# EAGLE design pc_ads1220_brk (EAGLE 6.4)
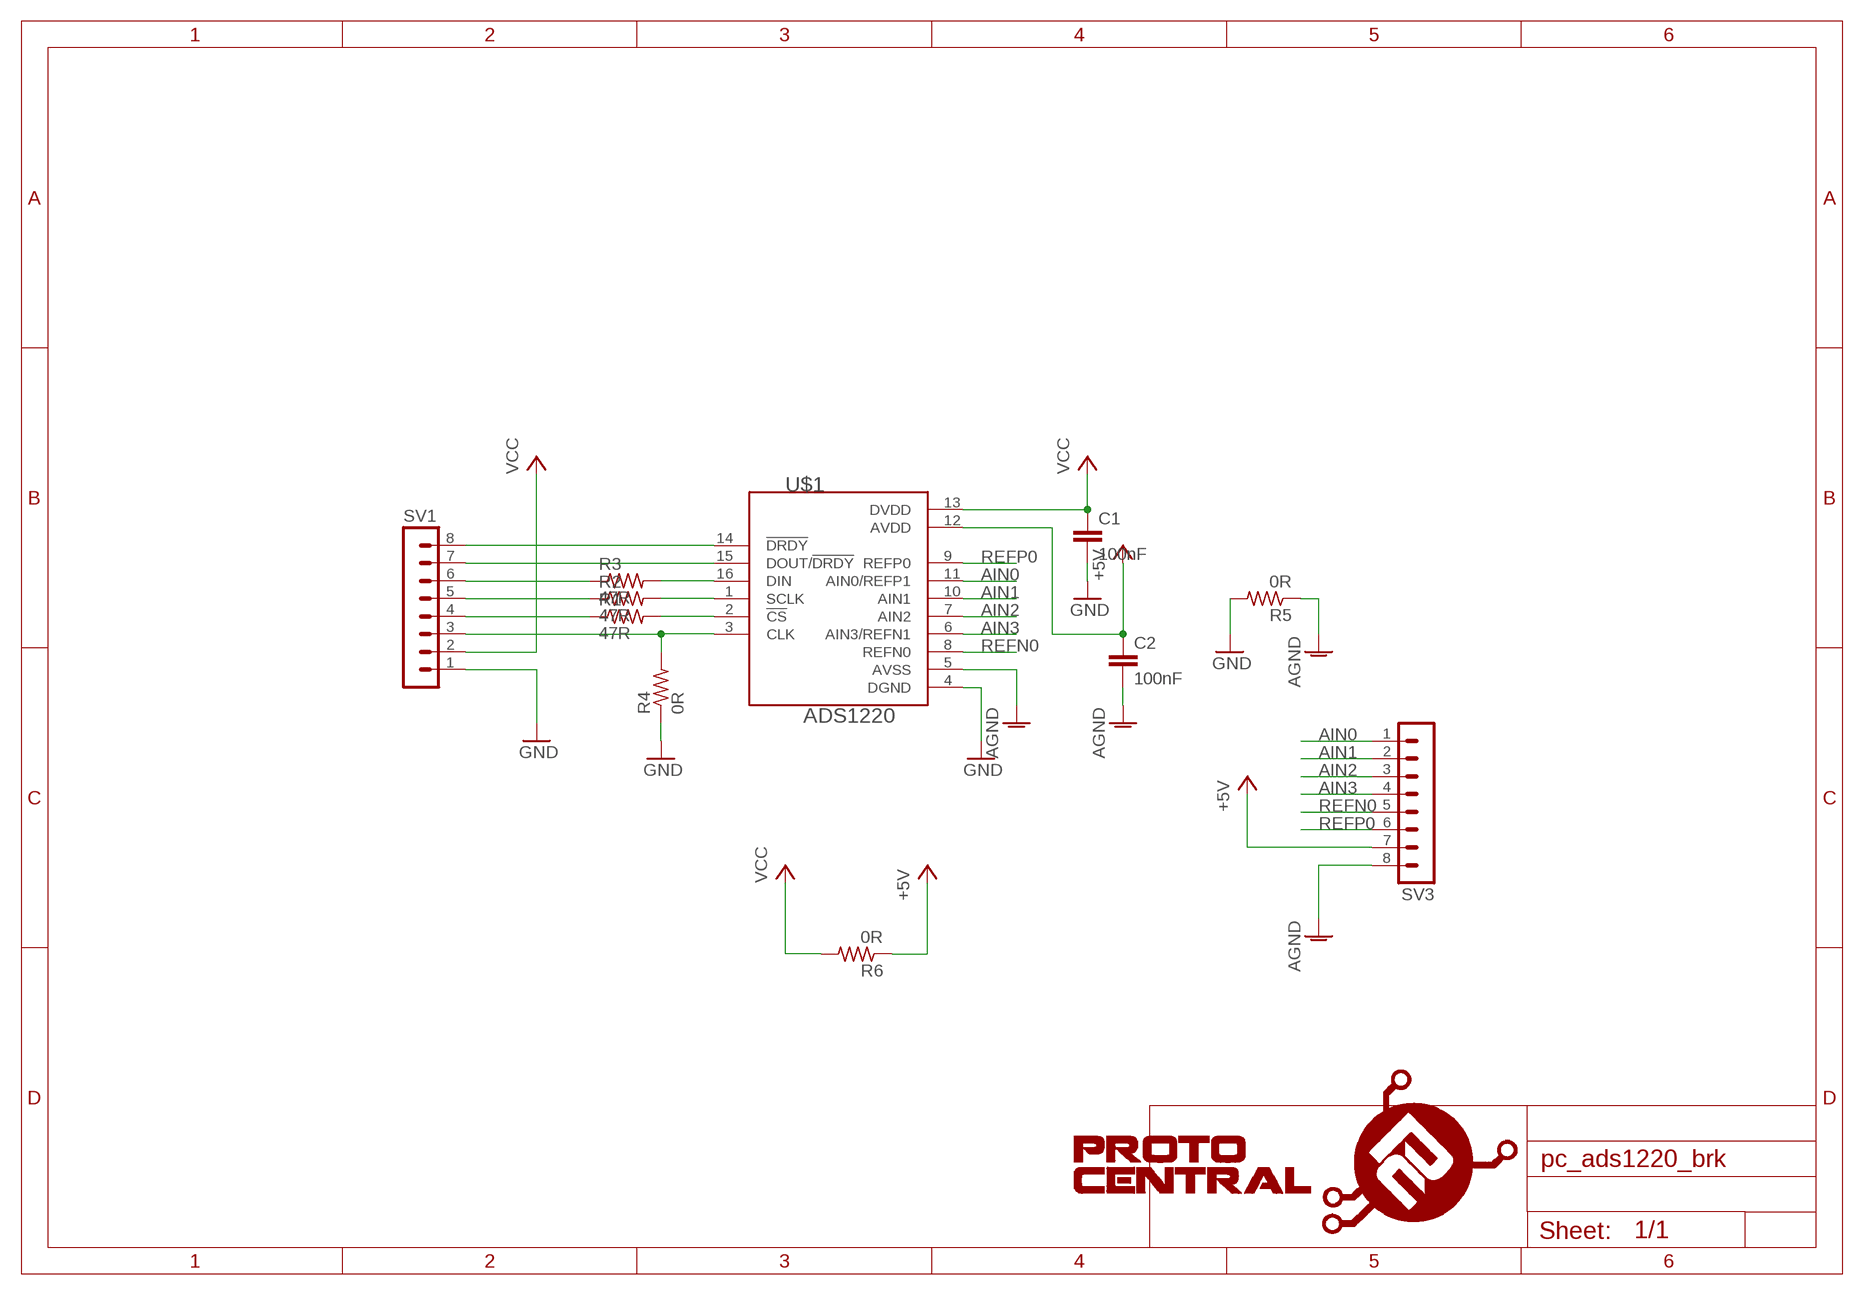
[diagram p0: schematic, sheet 1]

## Parts
C1  100nF  C-EUC0805  [C0805]
C2  100nF  C-EUC0805  [C0805]
R1  47R  R-US_R0805  [R0805]
R2  47R  R-US_R0805  [R0805]
R3  47R  R-US_R0805  [R0805]
R4  0R  R-US_R0805  [R0805]
R5  0R  R-US_R0805  [R0805]
R6  0R  R-US_R0805  [R0805]
SV1  MA08-1  [MA08-1]
SV3  MA08-1  [MA08-1]
U$1  ADS1220  [TSSOP-16]
U$3  PROTY_LOGO_WITH_TEXT  [PROTY_WITH_TEXT]

## Nets
+5V: C2.1 R6.1 SV3.7 U$1.12(AVDD)
AGND: C2.2 R5.1 SV3.8 U$1.5(AVSS)
AIN0: SV3.1 U$1.11(AIN0/REFP1)
AIN1: SV3.2 U$1.10(AIN1)
AIN2: SV3.3 U$1.7(AIN2)
AIN3: SV3.4 U$1.6(AIN3/REFN1)
GND: C1.2 R4.1 R5.2 SV1.1 U$1.4(DGND)
N$1: R3.1 SV1.6
N$2: R2.1 SV1.5
N$3: R3.2 U$1.16(DIN)
N$4: R2.2 U$1.1(SCLK)
N$5: R1.2 U$1.2(!CS)
N$6: R1.1 SV1.4
N$7: R4.2 SV1.3 U$1.3(CLK)
N$23: SV1.7 U$1.15(DOUT/!DRDY)
N$24: SV1.8 U$1.14(!DRDY)
REFN0: SV3.5 U$1.8(REFN0)
REFP0: SV3.6 U$1.9(REFP0)
VCC: C1.1 R6.2 SV1.2 U$1.13(DVDD)

## Library data of the parts
C1 C2 = rcl:C-EU: CAPACITOR, European symbol
R1-R6 = rcl:R-US_: RESISTOR, American symbol
SV1 SV3 = con-lstb:MA08-1: PIN HEADER; OC_FARNELL: unknown; OC_NEWARK: unknown
U$1 = circuitects:ADS1220
U$3 = circuitects:PROTY_LOGO_WITH_TEXT

## Board
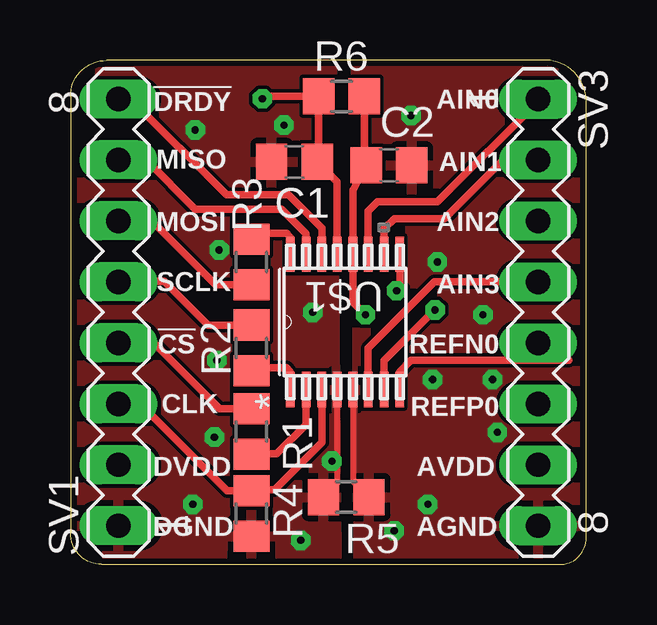
[diagram p1: board, top side]
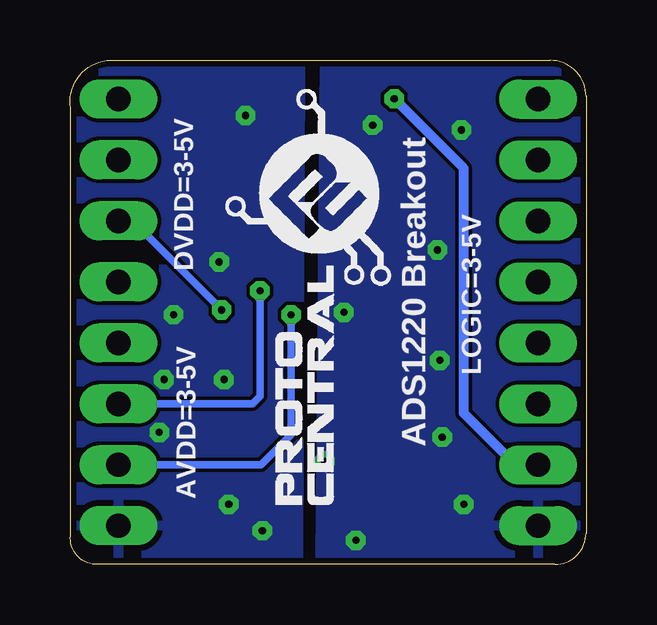
[diagram p2: board, bottom side, seen from below]

Size 21.52 x 21 mm. Coordinates in mm from the lower left corner, seen from the top.
Outline: 1.3,0 20.5,0 arc90 21.5,1.2 21.5,19 arc90 20,21 1.5,21 arc90 0,19.5 0,1.3 arc90 1.3,0
Copper layers (1*2*15*16): Top 0.035mm / dielectric 1.5mm / Route2 0.035mm / dielectric 0.15mm / Route15 0.035mm / dielectric 0.2mm / Bottom 0.035mm
Design rules "Circuitects-Rules": minimum track width 6mil, minimum drill 0.3mm, track to track 6mil, track to pad 6mil, pad to pad 6mil, via to via 6mil, smd to smd 6mil, copper to edge 10mil, drill to drill 8mil, minimum pad ring 12mil, minimum via ring 10mil, stop-mask expansion 4mil, vias tented up to drill 25mil, thermal gap 10mil

### Footprints (pad centres in the part's own frame; a part is rotated, then mirrored left to right if it is on the bottom)
C0805 = smd 1.3 x 1.5: 1 -0.95,0; 2 0.95,0
R0805 = smd 1.3 x 1.5: 1 -0.95,0; 2 0.95,0
MA08-1 = drill 1.016 long: 1 -8.89,0; 2 -6.35,0; 3 -3.81,0; 4 -1.27,0; 5 1.27,0; 6 3.81,0; 7 6.35,0; 8 8.89,0
TSSOP-16 = smd 1.473 x 0.356: 1 -2.819,2.656; 2 -2.819,1.996; 3 -2.819,1.335; 4 -2.819,0.7; 5 -2.819,0.04; 6 -2.819,-0.595; 7 -2.819,-1.256; 8 -2.819,-1.916; 9 2.819,-1.916; 10 2.819,-1.256; 11 2.819,-0.595; 12 2.819,0.04; 13 2.819,0.7; 14 2.819,1.335; 15 2.819,1.996; 16 2.819,2.656

### Placement (x,y rotation side)
C1  9.34,16.77 180 top
C2  13.28,16.63 0 top
R1  7.55,5.54 270 top
R2  7.55,9.02 270 top
R3  7.55,12.6 90 top
R4  7.55,2.12 90 top
R5  11.5,2.8 180 top
R6  11.3,19.5 180 top
SV1  2,10.5 90 top
SV3  19.5,10.5 270 top
U$1  11.82,10.1 90 top
U$3  8.1,1.4 90 bottom

### Tracks (layer width: path | path; a pad name or v marks a point on that pad's centre or on a via)
+5V  (via drill 0.3)
  Top 0.305: R6.1 12.25,16.71 C2.1 11.78,15.58 U$1.12 11.78,10.92 v12.3,10.4
  Bottom 0.305: v12.3,10.4 12.3,5.4 13.55,4.15 SV3.7
AGND  (via drill 0.3)
  Top 0.254: U$1.5 11.78,3.47 R5.1
  other vias: 15.3,12.6 14.9,2.5 14.2,18.7 13.5,1.4 15.1,7.7 17.8,5.5 17.6,7.7 17.2,10.4
  pour Bottom: 11.9,21.1 21.6,21 21.6,0 12,0
  pour Top: 11.9,21.1 21.6,20.9 21.6,-0.1 12,0
AIN0
  Top 0.305: U$1.11 12.41,14.71 12.8,15.1 15.3,15.1 19.59,19.39 SV3.1
AIN1
  Top 0.305: U$1.10 13.08,13.98 13.5,14.4 15.6,14.4 18.05,16.85 SV3.2
AIN2  (via drill 0.3)
  Top 0.305: U$1.7 13.08,8.48 v15.2,10.6
  Bottom 0.305: SV3.3 18.91,14.31 v15.2,10.6
AIN3
  Top 0.305: U$1.6 12.41,9.02 15.17,11.77 SV3.4
GND  (via drill 0.3)
  Top 0.254: U$1.4 11.12,3.37 R5.2
  other vias: 10.9,4.3 10.1,10.5 9.6,1 5.2,18.1 5.1,2.5 8.9,18.3 6,5.3 6.1,8.5 6.2,13.1
  pour Top: 0,21 10.9,21.1 11.1,0.2 0,0
  pour Bottom: 0,21 10.9,21.1 11.1,0.1 0,0
N$1
  Top 0.305: R3.1 6.05,11.65 3.4,14.3 SV1.6
N$2
  Top 0.305: R2.1 5.73,9.97 3.9,11.8 2.03,11.8 SV1.5
N$3
  Top 0.305: U$1.16 9.16,13.64 9,13.8 7.8,13.8 R3.2
N$4
  Top 0.305: U$1.1 9.16,8.04 9,8.2 7.68,8.2 R2.2
N$5
  Top 0.305: U$1.2 9.82,5.82 8.6,4.6 R1.2
N$6
  Top 0.305: R1.1 6.21,6.49 3.4,9.3 2.07,9.3 SV1.4
N$7
  Top 0.305: SV1.3 2.9,6.7 6.53,3.07 R4.2 7.58,3.1 8.5,3.1 10.48,5.08 U$1.3
N$23
  Top 0.305: U$1.15 9.82,13.78 8.8,14.8 5.2,14.8 3.15,16.85 SV1.7
N$24
  Top 0.305: U$1.14 10.48,14.02 9.1,15.4 6.5,15.4 2.51,19.39 SV1.8
REFN0
  Top 0.305: U$1.8 13.74,8.04 14.2,8.5 20.77,8.5 SV3.5
REFP0  (via drill 0.3)
  Top 0.305: U$1.9 13.74,11.54 v13.6,11.4
  Bottom 0.305: v13.6,11.4 13.6,7 13.91,6.69 SV3.6
VCC  (via drill 0.3)
  Top 0.305: v8,19.4 8.1,19.5 R6.2 10.35,16.83 C1.1 11.12,15.94 U$1.13
  Bottom 0.406: SV1.2 2.85,4.05 5.1,6.3 5.1,16.5 v8,19.4

### Text on the board
tPlace: !DRDY | AIN0 | MISO | AIN1 | MOSI | AIN2 | SCLK | AIN3 | !CS | REFN0 | REFP0 | CLK | DVDD | AVDD | DGND | AGND
bPlace: DVDD=3-5V | ADS1220 Breakout | LOGIC=3-5V | AVDD=3-5V